# EAGLE design fdc6326l_breakout_minimal (EAGLE 6.5.0)
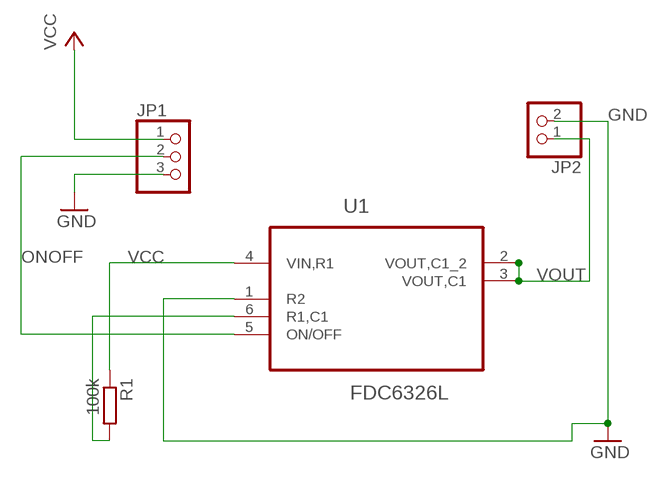
[diagram p0: schematic, sheet 1]

## Parts
JP1  PINHD-1X3  [1X03]
JP2  PINHD-1X2  [1X02]
R1  100k  R-EU_M0805  [M0805]
U1  FDC6326L  [SOT95P280X110-6N]

## Nets
GND: JP1.3 JP2.2 U1.1(R2)
N$3: R1.2 U1.6(R1,C1)
ONOFF: JP1.2 U1.5(ON/OFF)
VCC: JP1.1 R1.1 U1.4(VIN,R1)
VOUT: JP2.1 U1.2(VOUT,C1_2) U1.3(VOUT,C1)

## Library data of the parts
JP1 = pinhead:PINHD-1X3: PIN HEADER
JP2 = pinhead:PINHD-1X2: PIN HEADER
R1 = rcl:R-EU_: RESISTOR, European symbol
U1 = Fairchild_By_element14_Batch_1:FDC6326L: Integrated Load Switch; MPN: FDC6326L; OC_FARNELL: 1706325; OC_NEWARK: 58K1423; PACKAGE: SSOT-23-6; SUPPLIER: FAIRCHILD SEMICONDUCTOR

## Board
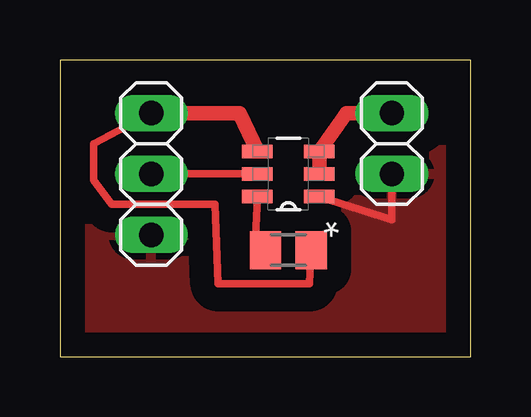
[diagram p1: board, top side]

Size 17.12 x 12.37 mm. Coordinates in mm from the lower left corner, seen from the top.
Outline: 0,0 17.12,0 17.12,12.37 0,12.37 0,0
Copper layers 1: Top 0.035mm
Design rules "1l": minimum track width 6mil, minimum drill 24mil, track to track 8mil, track to pad 8mil, pad to pad 8mil, via to via 8mil, smd to smd 8mil, copper to edge 40mil, drill to drill 8mil, minimum pad ring 10mil, minimum via ring 8mil, stop-mask expansion 4mil, vias tented up to drill 0mil, thermal gap 10mil

### Footprints (pad centres in the part's own frame; a part is rotated, then mirrored left to right if it is on the bottom)
1X03 = drill 1.016 long: 1 -2.54,0; 2 0,0; 3 2.54,0
1X02 = drill 1.016 long: 1 -1.27,0; 2 1.27,0
M0805 = smd 1.3 x 1.6: 1 -0.95,0; 2 0.95,0
SOT95P280X110-6N = smd 1.27 x 0.559: 1 -1.295,0.94; 2 -1.295,0; 3 -1.295,-0.94; 4 1.295,-0.94; 5 1.295,0; 6 1.295,0.94

### Placement (x,y rotation side)
JP1  3.81,7.62 270 top
JP2  13.84,8.89 270 top
R1  9.53,4.45 180 top
U1  9.53,7.62 180 top

### Tracks (layer width: path | path; a pad name or v marks a point on that pad's centre or on a via)
GND
  Top 0.305: U1.1 13.84,5.71 JP2.2
  pour Top (isolate 1.016): 0,12.7 0,0 17.14,0 17.14,12.7
N$3
  Top 0.305: U1.6 8.13,4.57 R1.2
ONOFF
  Top 0.305: JP1.2 U1.5
VCC
  Top 0.305: R1.1 10.41,3.05 6.6,3.05 6.48,6.35 2.16,6.35 1.4,7.37 1.4,8.89 JP1.1
  Top 0.61: JP1.1 7.49,10.16 U1.4
VOUT
  Top 0.61: U1.2 U1.3 11.94,10.16 JP2.1